# Altium schematic sheet battery_interface.SchDoc: Battery Controller
size A1; Date: 2015-09-21; Author: Piotr Kuligowski; DocumentNumber: 1; Revision: 1-0; SheetNumber: 1; SheetTotal: 14; Model: EM1
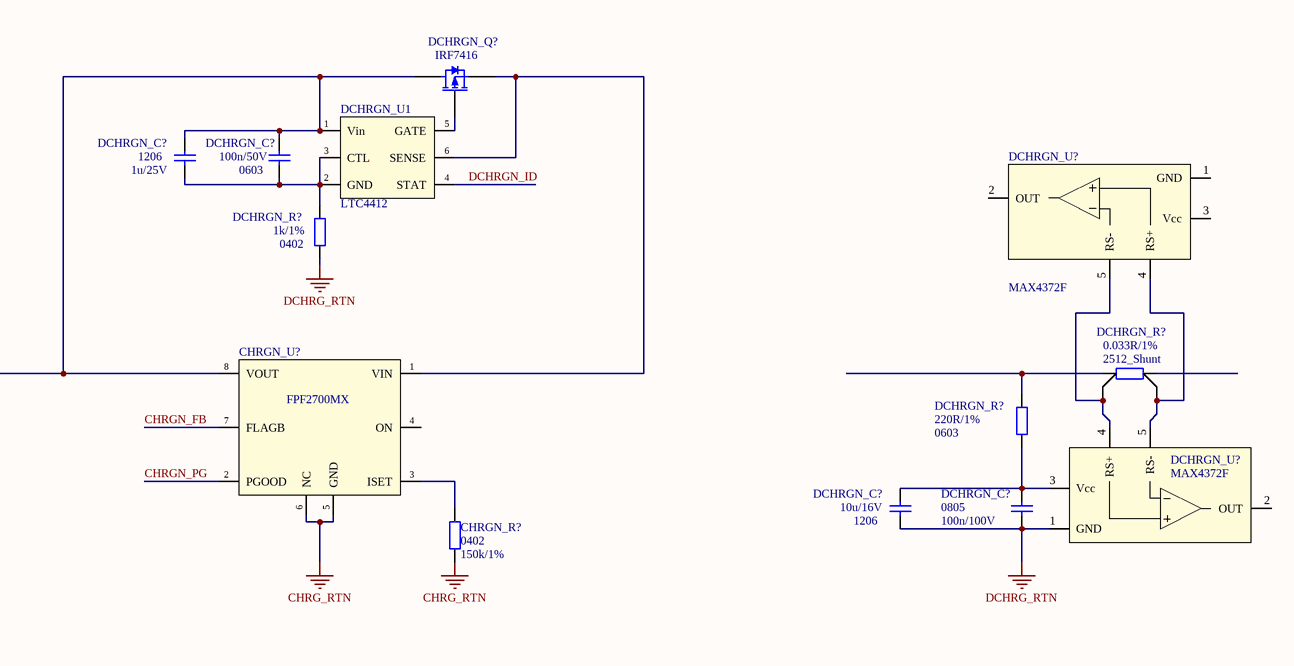
[diagram p0: battery_interface.SchDoc, top left]
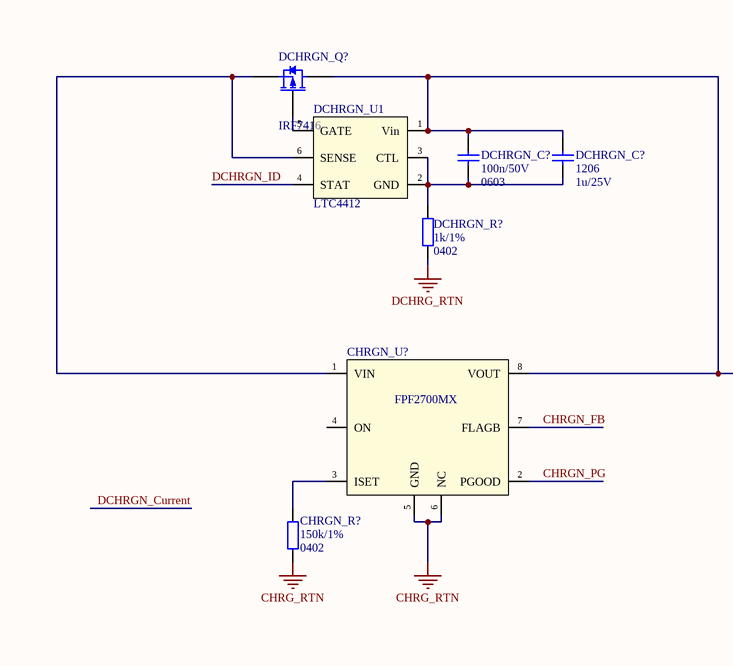
[diagram p1: battery_interface.SchDoc, top right]
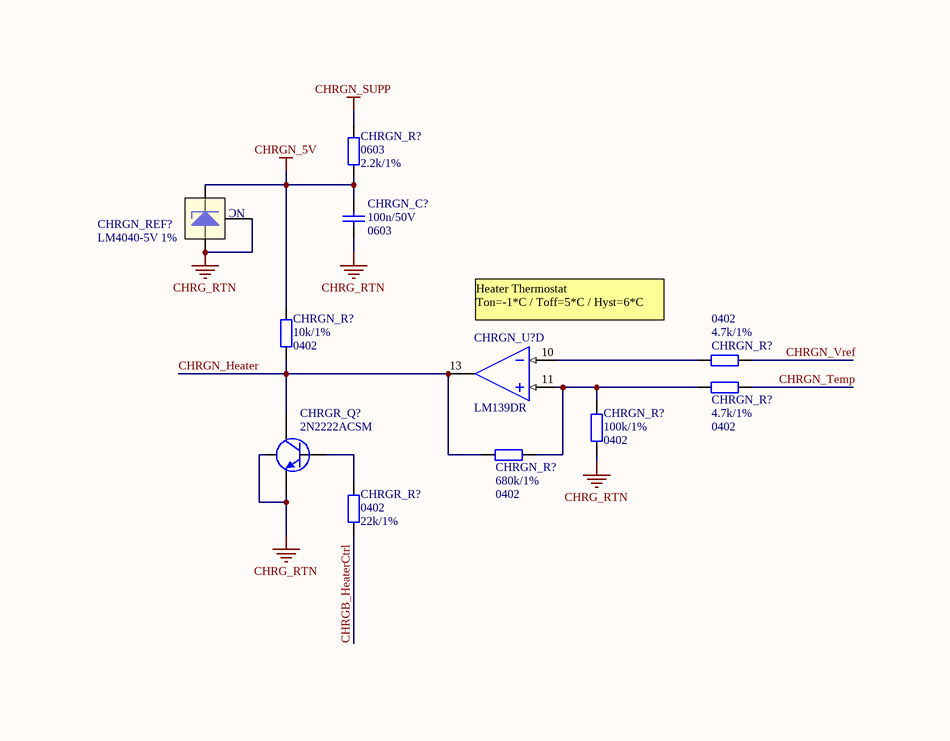
[diagram p2: battery_interface.SchDoc, bottom left]
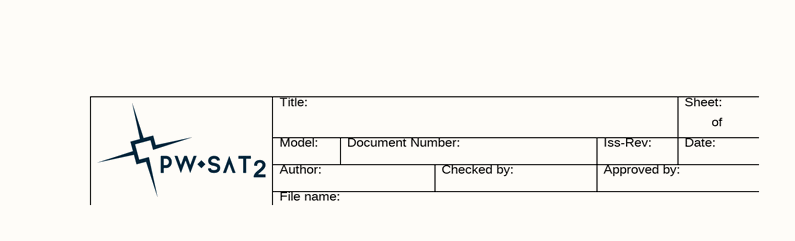
[diagram p3: battery_interface.SchDoc, bottom right]

## Parts
(Parts that share a designator on the sheet are numbered #1, #2 ... from top to bottom, then left to right.)
CHRGN_C?  Package: 0603  [SMD_Capacitor_0603]  (hidden comment: 100n/50V)
CHRGN_R?#1  Package: 0402  [SMD_Resistor_0402]  (hidden comment: 150k/1%)
CHRGN_R?#2  Package: 0402  [SMD_Resistor_0402]  (hidden comment: 150k/1%)
CHRGN_R?#3  Package: 0603  [SMD_Resistor_0603]  (hidden comment: 2.2k/1%)
CHRGN_R?#4  Package: 0402  [SMD_Resistor_0402]  (hidden comment: 10k/1%)
CHRGN_R?#5  Package: 0402  [SMD_Resistor_0402]  (hidden comment: 4.7k/1%)
CHRGN_R?#6  Package: 0402  [SMD_Resistor_0402]  (hidden comment: 4.7k/1%)
CHRGN_R?#7  Package: 0402  [SMD_Resistor_0402]  (hidden comment: 100k/1%)
CHRGN_R?#8  Package: 0402  [SMD_Resistor_0402]  (hidden comment: 680k/1%)
CHRGN_REF?  LM4040-5V 1%  [SOT23-3]
CHRGN_U?#1  FPF2700MX  [SOIC-8-N]
CHRGN_U?#2  FPF2700MX  [SOIC-8-N]
CHRGN_U?#3  LM139DR  [SOIC-14-N]  (part D of 5)
CHRGR_Q?  2N2222ACSM  [LCC1-4_BEC]
CHRGR_R?  Package: 0402  [SMD_Resistor_0402]  (hidden comment: 22k/1%)
DCHRGN_C?#1  Package: 1206  [SMD_Capacitor_1206]  (hidden comment: 1u/25V)
DCHRGN_C?#2  Package: 0603  [SMD_Capacitor_0603]  (hidden comment: 100n/50V)
DCHRGN_C?#3  Package: 0603  [SMD_Capacitor_0603]  (hidden comment: 100n/50V)
DCHRGN_C?#4  Package: 1206  [SMD_Capacitor_1206]  (hidden comment: 1u/25V)
DCHRGN_C?#5  Packge: 1206  [SMD_Capacitor_1206]  (hidden comment: 10u/16V)
DCHRGN_C?#6  Package: 0805  [SMD_Capacitor_0805]  (hidden comment: 100n/100V)
DCHRGN_Q?#1  IRF7416  [SOIC-8-N_SSSGDDDD]
DCHRGN_Q?#2  IRF7416  [SOIC-8-N_SSSGDDDD]
DCHRGN_R?#1  Package: 0402  [SMD_Resistor_0402]  (hidden comment: 1k/1%)
DCHRGN_R?#2  Package: 0402  [SMD_Resistor_0402]  (hidden comment: 1k/1%)
DCHRGN_R?#3  Package: 2512_Shunt  [SMD_Resistor-shunt_2512]  (hidden comment: 0.033R/1%)
DCHRGN_R?#4  Package: 0603  [SMD_Resistor_0603]  (hidden comment: 220R/1%)
DCHRGN_U1#1  LTC4412  [SOT23-6]
DCHRGN_U1#2  LTC4412  [SOT23-6]
DCHRGN_U?#1  MAX4372F  [SOT23-5]
DCHRGN_U?#2  MAX4372F  [SOT23-5]

## Nets
CHRG_RTN: CHRGN_C?.2 CHRGN_R?#1.2 CHRGN_R?#2.2 CHRGN_R?#7.2 CHRGN_REF?.2(A) CHRGN_REF?.3(NC) CHRGN_U?#1.5(GND) CHRGN_U?#1.6(NC) CHRGN_U?#2.5(GND) CHRGN_U?#2.6(NC) CHRGR_Q?.E CHRGR_Q?.Shield
CHRGN_5V: CHRGN_C?.1 CHRGN_R?#3.1 CHRGN_R?#4.1 CHRGN_REF?.1(K)
CHRGN_SUPP: CHRGN_R?#3.2
DCHRG_RTN: DCHRGN_C?#5.2 DCHRGN_C?#6.2 DCHRGN_R?#1.2 DCHRGN_R?#2.2 DCHRGN_U?#2.1(GND)
CHRGB_HeaterCtrl: CHRGR_R?.2
CHRGN_FB: CHRGN_U?#1.7(FLAGB) CHRGN_U?#2.7(FLAGB)
CHRGN_Heater: CHRGN_R?#4.2 CHRGN_R?#8.2 CHRGN_U?#3.13(4OUT) CHRGR_Q?.C
CHRGN_PG: CHRGN_U?#1.2(PGOOD) CHRGN_U?#2.2(PGOOD)
CHRGN_Temp: CHRGN_R?#6.2
CHRGN_Vref: CHRGN_R?#5.1
DCHRGN_ID: DCHRGN_U1#1.4(STAT) DCHRGN_U1#2.4(STAT)
NetCHRGN_R?#1_1: CHRGN_R?#1.1 CHRGN_U?#1.3(ISET)
NetCHRGN_R?#2_1: CHRGN_R?#2.1 CHRGN_U?#2.3(ISET)
NetCHRGN_R?#5_2: CHRGN_R?#5.2 CHRGN_U?#3.10(4IN-)
NetCHRGN_R?#6_1: CHRGN_R?#6.1 CHRGN_R?#7.1 CHRGN_R?#8.1 CHRGN_U?#3.11(4IN+)
NetCHRGN_U?#1_1: CHRGN_U?#1.1(VIN) DCHRGN_Q?#1.S DCHRGN_U1#1.6(SENSE)
NetCHRGN_U?#1_8: CHRGN_U?#1.8(VOUT) DCHRGN_C?#1.1 DCHRGN_C?#2.1 DCHRGN_Q?#1.D DCHRGN_U1#1.1(Vin)
NetCHRGN_U?#2_1: CHRGN_U?#2.1(VIN) DCHRGN_Q?#2.S DCHRGN_U1#2.6(SENSE)
NetCHRGN_U?#2_8: CHRGN_U?#2.8(VOUT) DCHRGN_C?#3.1 DCHRGN_C?#4.1 DCHRGN_Q?#2.D DCHRGN_U1#2.1(Vin)
NetCHRGR_Q?_B: CHRGR_Q?.B CHRGR_R?.1
NetDCHRGN_C?#1_2: DCHRGN_C?#1.2 DCHRGN_C?#2.2 DCHRGN_R?#1.1 DCHRGN_U1#1.2(GND) DCHRGN_U1#1.3(CTL)
NetDCHRGN_C?#3_2: DCHRGN_C?#3.2 DCHRGN_C?#4.2 DCHRGN_R?#2.1 DCHRGN_U1#2.2(GND) DCHRGN_U1#2.3(CTL)
NetDCHRGN_C?#5_1: DCHRGN_C?#5.1 DCHRGN_C?#6.1 DCHRGN_R?#4.2 DCHRGN_U?#2.3(Vcc)
NetDCHRGN_Q?#1_G: DCHRGN_Q?#1.G DCHRGN_U1#1.5(GATE)
NetDCHRGN_Q?#2_G: DCHRGN_Q?#2.G DCHRGN_U1#2.5(GATE)
NetDCHRGN_R?#3_1: DCHRGN_R?#3.1 DCHRGN_R?#4.1
NetDCHRGN_R?#3_2: DCHRGN_R?#3.2 DCHRGN_U?#1.5(RS-) DCHRGN_U?#2.4(RS+)
NetDCHRGN_R?#3_3: DCHRGN_R?#3.3 DCHRGN_U?#1.4(RS+) DCHRGN_U?#2.5(RS-)

Not connected (* = marked no-connect by the designer): CHRGN_U?#1 4(ON); CHRGN_U?#2 4(ON); DCHRGN_R?#3 4; DCHRGN_U?#1 1(GND) 2(OUT) 3(Vcc); DCHRGN_U?#2 2(OUT)

## Notes on the sheet
- Heater Thermostat
  Ton=-1*C / Toff=5*C / Hyst=6*C
- Title:
- Sheet:
- of
- Author:
- Model:
- File name:
- Document Number:
- Checked by:
- Iss-Rev:
- Approved by:
- Date:

## Library data of the parts
CHRGN_C? DCHRGN_C?#2 DCHRGN_C?#3 = Cer_C0603T104K5RALTU: Ceramic Cap Kemet COTS 100n/50V X7R 0603; Manufacturer: Kemet; ManufacturerPartNumber: C0603T104K5RALTU; Value: 100n/50V
CHRGN_R?#1 CHRGN_R?#2 = CRCW0402150KFKxxxx: 150k/1% Vishay CRCW 0402 Resistor. 63mW, 100ppm, 50V.; Manufacturer: Vishay; ManufacturerPartNumber: CRCW0402150KFKxxxx; Value: 150k/1%
CHRGN_R?#3 = CRCW06032K20FKxxxx: 2.2k/1% Vishay CRCW 0603 Resistor. 100mW, 100ppm, 75V.; ManufacturerPartNumber: CRCW06032K20FKxxxx; Manufacturer: Vishay; Value: 2.2k/1%
CHRGN_R?#4 = CRCW040210K0FKxxxx: 10k/1% Vishay CRCW 0402 Resistor. 63mW, 100ppm, 50V.; Manufacturer: Vishay; ManufacturerPartNumber: CRCW040210K0FKxxxx; Value: 10k/1%
CHRGN_R?#5 CHRGN_R?#6 = CRCW04024K70FKxxxx: 4.7k/1% Vishay CRCW 0402 Resistor. 63mW, 100ppm, 50V.; ManufacturerPartNumber: CRCW04024K70FKxxxx; Manufacturer: Vishay; Value: 4.7k/1%
CHRGN_R?#7 = CRCW0402100KFKxxxx: 100k/1% Vishay CRCW 0402 Resistor. 63mW, 100ppm, 50V.; Manufacturer: Vishay; ManufacturerPartNumber: CRCW0402100KFKxxxx; Value: 100k/1%
CHRGN_R?#8 = CRCW0402680KFKxxxx: 680k/1% Vishay CRCW 0402 Resistor. 63mW, 100ppm, 50V.; ManufacturerPartNumber: CRCW0402680KFK; Manufacturer: Vishay; Value: 680k/1%
CHRGN_REF? = LM4040DIM3-5.0: Shunt V-REF, 5V, 1%, SOT23-3; Manufacturer: Texas Instruments; ManufacturerPartNumber: LM4040DIM3-5.0; Value: LM4040-5V 1%
CHRGN_U?#1 CHRGN_U?#2 = FPF2700MX: Adj over-current protection 0.4-2A, Load Switch; Manufacturer: Fairchild Semiconductor; Value: FPF2700MX
CHRGN_U?#3 = LM139DR_TI: LM139 Quad Differential Comparator; Manufacturer: Texas Instruments; Value: LM139DR
CHRGR_Q? = 2N2222ACSM: Silicon Planar Epitaxial NPN Transistor.; Manufacturer: Semelab-TT; Value: 2N2222ACSM
CHRGR_R? = CRCW040222K0FKxxxx: 22k/1% Vishay CRCW 0402 Resistor. 63mW, 100ppm, 50V.; Manufacturer: Vishay; ManufacturerPartNumber: CRCW040222K0FKxxxx; Value: 22k/1%
DCHRGN_C?#1 DCHRGN_C?#4 = Cer_C1206T105K3RALTU: Ceramic Cap Kemet COTS 1u/25V X7R 1206; ManufacturerPartNumber: C1206T105K3RALTU; Manufacturer: Kemet; Value: 1u/25V
DCHRGN_C?#5 = Cer_C1206T106K4RACTU: Ceramic Cap Kemet COTS 10u/16V X7R 1206; ManufacturerPartNumber: C1206T106K4RACTU; Manufacturer: Kemet; Value: 10u/16V
DCHRGN_C?#6 = Cer_C0805T104K1RCLTU: Ceramic Cap Kemet COTS 100n/100V X7R 0805; ManufacturerPartNumber: C0805T104K1RCLTU; Manufacturer: Kemet; Value: 100n/100V
DCHRGN_Q?#1 DCHRGN_Q?#2 = IRF7416: 10A/30V HEXFET Power P-MOSFET.; Manufacturer: International Rectifier; Value: IRF7416
DCHRGN_R?#1 DCHRGN_R?#2 = CRCW04021K00FKxxxx: 1k/1% Vishay CRCW 0402 Resistor. 63mW, 100ppm, 50V.; Manufacturer: Vishay; ManufacturerPartNumber: CRCW04021K00FKxxxx; Value: 1k/1%
DCHRGN_R?#3 = LR2512-R033FW: 33mR ,1%, 2W, shunt resistor, TE Connectivity.; ManufacturerPartNumber: LR2512-R033FW; Manufacturer: TE Connectivity; Power Rating: 2W; Value: 0.033R/1%
DCHRGN_R?#4 = CRCW0603220RFKxxxx: 220R/1% Vishay CRCW 0603 Resistor. 100mW, 100ppm, 75V.; ManufacturerPartNumber: CRCW0603220RFKxxxx; Manufacturer: Vishay; Value: 220R/1%
DCHRGN_U1#1 DCHRGN_U1#2 = LTC4412: Ideal Diode, Low Loss PowerPath Controller.; Manufacturer: Linear Technology; Value: LTC4412
DCHRGN_U?#1 DCHRGN_U?#2 = MAX4372: High-Side Current-Sense Amplifier with Voltage Output; Manufacturer: Maxim Integrated Products; Value: MAX4372F